# Altium project PCB_Project.PrjPcb
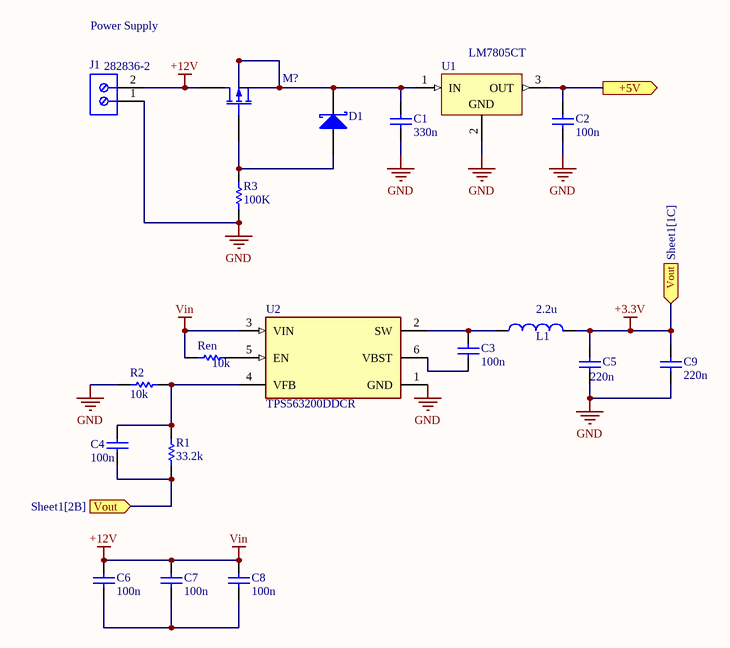
[diagram p0: Sheet1.SchDoc]
1 sheet, 19 parts. Net scope: flat (ports and power ports of the same name join across sheets).

## Sheet Sheet1.SchDoc
size A4; SheetNumber: 1; SheetTotal: 1; SPICEModelCacheNAEVHLDJ: <root> / <DocumentId>NAEVHLDJ</DocumentId> / </root>

### Parts
C1  value 330n  (hidden comment: Capacitor)
C2  value 100n  (hidden comment: Capacitor)
C3  value 100n  (hidden comment: Capacitor)
C4  value 100n  (hidden comment: Capacitor)
C5  value 220n  (hidden comment: Capacitor)
C6  value 100n  (hidden comment: Capacitor)
C7  value 100n  (hidden comment: Capacitor)
C8  value 100n  (hidden comment: Capacitor)
C9  value 220n  (hidden comment: Capacitor)
D1  Shottky Diode  (value not drawn)
J1  282836-2  [TECO-282836-2_V]
L1  value 2.2u  (hidden comment: Inductor)
M?  P-channel MOSFET MOS9 Model  (value not drawn)
R1  value 33.2k  (hidden comment: Resistor)
R2  value 10k  (hidden comment: Resistor)
R3  value 100K  (hidden comment: Resistor)
Ren  value 10k  (hidden comment: Resistor)
U1  LM7805CT  [FAIR-TO-220-3]
U2  TPS563200DDCR  [FP-DDC0006A-MFG]

### Ports
+5V (out), Vout (in, see Sheet1[1C]), Vout (in, see Sheet1[2B])

### Nets
+3.3V: C4.1 C5.2 C9.2 L1.2 R1.1 ; port Vout
+12V: C6.2 C7.2 C8.2 J1.2 M?.1(D) Ren.1 U2.3(VIN)  [also labelled Vin]
GND: C1.1 C2.1 C5.1 C9.1 J1.1 R2.1 R3.1 U1.2(GND) U2.1(GND)
NetC1_2: C1.2 D1.2(K) M?.3(S) M?.4(B) U1.1(IN)
NetC2_2: C2.2 U1.3(OUT) ; port +5V
NetC3_1: C3.1 U2.6(VBST)
NetC3_2: C3.2 L1.1 U2.2(SW)
NetC4_2: C4.2 R1.2 R2.2 U2.4(VFB)
NetC6_1: C6.1 C7.1 C8.1
NetD1_1: D1.1(A) M?.2(G) R3.2
NetRen_2: Ren.2 U2.5(EN)

### Notes on the sheet
- Power Supply

### Library data of the parts
C1-C9 = Capacitor: SimulationGenericComponent: True
D1 = Shottky Diode: AF: 1; BV: 0; BV_MAX: 1e99; EG: 1.11; FC: 0.5; IBV: 0.001; IS: 1e-14; MJSW: 0.33; NTUN: 30; TNOM: 27; XTI: 3; SimulationGenericComponent: True; CJO: 0; CJP: 0; CTA: 0; CTP: 0; FCS: 0.5; FV_MAX: 1e99; IKF: 0; IKR: 0; ISR: 1e-14; JSW: 0; JTUN: 0; JTUNSW: 0; KEG: 1; KF: 0; LEVEL: 1; N: 1; NBV: 1; NR: 1; NS: 1; PHP: 1; RS: 0; TCV: 0; TLEV: 0; TLEVC: 0; TM1: 0; TM2: 0; TPB: 0; TPHP: 0; TRS: 0; TRS2: 0; TT: 0; TTT1: 0; TTT2: 0; VJ: 1; XTITUN: 3
J1 = CMP-1684-00017-1: Female Header, Pitch 5 mm, 1 x 2 Position, Height 10 mm, Tail Length 3.5 mm, Rohs, Bulk; Manufacturer: TE Connectivity; Wire Gauge: 16-30AWG; Product Training Modules: Wire-to-BoardEurostyleTerminalBlocks; Clamp Material - Plating: Brass-NickelPlated; Voltage: 300V; Mating Orientation: HorizontalwithBoard; Current: 13.5A; Pitch: 0.197"(5.00mm); Screw Thread: M3; 3D Model: 282836-2.pdf; Other Names: 5ULV-02B / A98076; Dynamic Catalog: BuchananSeries; Number of Levels: 1; Torque - Screw: 0.68Nm(6Lb-In); Featured Product: EurostyleTerminalBlockConnectors; Positions Per Level: 2; Wire Termination: Screw-RisingCageClamp; Datasheet URL: http://www.te.com.cn/commerce/DocumentDelivery/DDEController?Action=showdoc&DocId=Catalog+Section%7F1308389_EUROSTYLE_TERMINAL_BLOCKS%7F0607%7Fpdf%7FEnglish%7FENG_CS_1308389_EUROSTYLE_TERMINAL_BLOCKS_0607.pdf%7F282836-2; Color: Green; Family: TerminalBlocks-WiretoBoard; RoHS Information: 282836-2StatementofCompliance; Standard Package: 300; Contact Material - Plating: Brass-TinPlated; Manufacturer URL: http://www.te.com; Housing Material: Polyamide(PA66),Nylon6/6; Features: Interlocking(Side); Package Description: Female Header, Pitch 5 mm, 1 x 2 Position, Height 10 mm, Tail Length 3.5 mm; Mounting Type: ThroughHole; Package Reference: THD; Packaging: Bulk; Series: Buchanan; Category: Connectors,Interconnects; Screw Material - Plating: Brass-NickelPlated
L1 = Inductor: SimulationGenericComponent: True
M? = MOSFET P-ch Lev9: AF: 1; ALPHA: 0; FC: 0.5; IS: 1e-14; KAPPA: 0.2; KP: 2.07189e-05; MJSW: 0.33; PB: 0.8; PHI: 0.6; TNOM: 27; TOX: 1e-07; U0: 600; SimulationGenericComponent: True; CBD: 0; CBS: 0; CGBO: 0; CGDO: 0; CGSO: 0; CJ: 0; CJSW: 0; DELTA: 0; DELVTO: 0; ETA: 0; GAMMA: 0; INPUT_DELTA: 0; JS: 0; KF: 0; LD: 0; MJ: 0.5; NFS: 0; NSS: 0; NSUB: 0; RD: 0; RS: 0; RSH: 0; THETA: 0; TPG: 0; VMAX: 0; VTO: 0; WD: 0; XD: 0; XJ: 0; XL: 0; XW: 0
R1-R3 Ren = Resistor: TC1: 0; SimulationGenericComponent: True; TC2: 0
U1 = CMP-2000-04938-1: Positive Voltage Regulator, 5 V, 1 A, -40 to 125 degC, 3-Pin TO-220, RoHS, Tube; Manufacturer: FairchildSemiconductor; Maximum Input Voltage: 35V; Maximum Quiescent Current: 8mA; Load Regulation: 100mV; Maximum Output Current: 2.2(Typ)A; Output Type: Fixed; Typical Dropout Voltage @ Current: 2@1AV; Rad Hard: No; Output Voltage: 5V; Accuracy: ±4%; Number of Outputs: 1; Category: LinearRegulator; Package Description: 3-Pin Through Hole Device, Body 10 x 4.5 mm, Pitch 2.54 mm; Packaging: Rail/Tube; Mounting: ThroughHole; Polarity: Positive; Manufacturer URL: https://www.fairchildsemi.com/; Line Regulation: 100mV; Datasheet Version: Aug-12; Datasheet URL: https://datasheet.ciiva.com/26904/lm7805ct-26904988.pdf; Package Reference: TO-220; Package URL: https://www.fairchildsemi.com/package-drawings/TO/TO220B03.pdf; Package: 3TO-220AB; Operating Temperature: -40to125degC; Type: Linear
U2 = CMP-04918-000155-1: IC REG BUCK ADJ 3A TSOT23-6; Quiescent Current: 190uA; Output Voltage: 7V; Min Input Voltage: 4.5V; Output Configuration: Positive; Number of Outputs: 1; Switching Frequency: 650kHz; Synchronous Rectifier: Yes; Min Output Voltage: 760mV; Output Type: Adjustable; Operating Supply Voltage: 17V; Max Operating Temperature: 125°C; Lead Free: Lead Free; Packaging: Tape and Reel; Radiation Hardening: No; Mount: Surface Mount; Contact Plating: Tin; Output Current: 3A; Max Output Voltage: 7V; Min Operating Temperature: -40°C; Case/Package: SOT-23-6; Max Output Current: 3A; Max Input Voltage: 17V